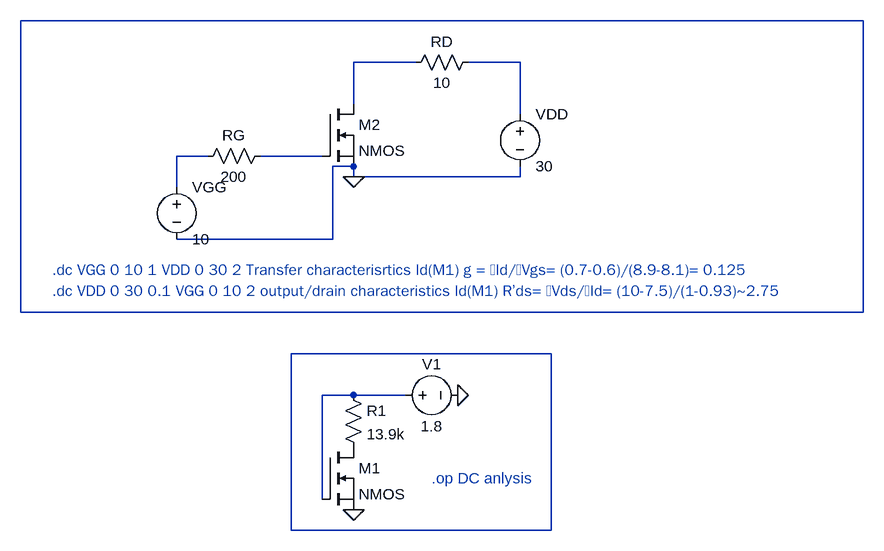
[diagram p0: schematic mosfet.asc]
mosfet.asc, the LTspice schematic file:
Version 4
SHEET 1 1764 868
WIRE 1760 80 464 80
WIRE 1072 144 976 144
WIRE 1232 144 1152 144
WIRE 976 208 976 144
WIRE 1232 224 1232 144
WIRE 752 288 704 288
WIRE 928 288 832 288
WIRE 976 304 944 304
WIRE 976 320 976 304
WIRE 1232 320 1232 304
WIRE 1232 320 976 320
WIRE 704 336 704 288
WIRE 944 416 944 304
WIRE 944 416 704 416
WIRE 464 528 464 80
WIRE 1760 528 1760 80
WIRE 1760 528 464 528
WIRE 1280 592 880 592
WIRE 976 656 928 656
WIRE 1056 656 976 656
WIRE 928 816 928 656
WIRE 880 864 880 592
WIRE 1280 864 1280 592
WIRE 1280 864 880 864
FLAG 976 320 0
FLAG 1136 656 0
FLAG 976 832 0
SYMBOL nmos 928 208 R0
SYMATTR InstName M2
SYMBOL voltage 1232 208 R0
WINDOW 123 0 0 Left 0
WINDOW 39 0 0 Left 0
SYMATTR InstName VDD
SYMATTR Value 30
SYMBOL res 1168 128 R90
WINDOW 0 0 56 VBottom 2
WINDOW 3 32 56 VTop 2
SYMATTR InstName RD
SYMATTR Value 10
SYMBOL res 848 272 R90
WINDOW 0 0 56 VBottom 2
WINDOW 3 32 56 VTop 2
SYMATTR InstName RG
SYMATTR Value 200
SYMBOL voltage 704 320 R0
SYMATTR InstName VGG
SYMATTR Value 10
SYMBOL nmos 928 736 R0
SYMATTR InstName M1
SYMBOL res 960 640 R0
SYMATTR InstName R1
SYMATTR Value 13.9k
SYMBOL voltage 1040 656 R270
WINDOW 0 32 56 VTop 2
WINDOW 3 -32 56 VBottom 2
SYMATTR InstName V1
SYMATTR Value 1.8
TEXT 512 464 Left 2 ;.dc VGG 0 10 1 VDD 0 30 2 Transfer characterisrtics Id(M1) g = ꓥId/ꓥVgs= (0.7-0.6)/(8.9-8.1)= 0.125
TEXT 512 496 Left 2 ;.dc VDD 0 30 0.1 VGG 0 10 2 output/drain characteristics Id(M1) R’ds= ꓥVds/ꓥId= (10-7.5)/(1-0.93)~2.75
TEXT 1096 784 Left 2 ;.op DC anlysis

The netlist it stands for:
* mosfet.asc
M2 N002 N005 0 0 NMOS
VDD N003 0 30
RD N003 N002 10
RG N005 N004 200
VGG N004 0 10
M1 P001 N007 0 0 NMOS
R1 N007 P001 13.9k
V1 N007 0 1.8
.model NMOS NMOS
.model PMOS PMOS
.lib standard.mos
* .dc VGG 0 10 1 VDD 0 30 2 Transfer characterisrtics Id(M1) g = ꓥId/ꓥVgs= (0.7-0.6)/(8.9-8.1)= 0.125
* .dc VDD 0 30 0.1 VGG 0 10 2 output/drain characteristics Id(M1) R’ds= ꓥVds/ꓥId= (10-7.5)/(1-0.93)~2.75
* .op DC anlysis
.backanno
.end